# Altium schematic sheet OneRealayNode.SchDoc
size A4
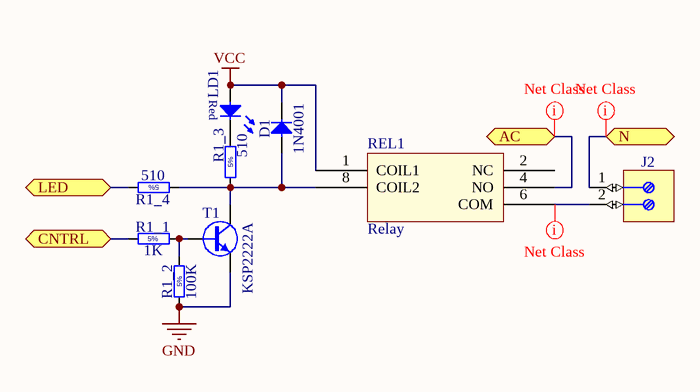
[diagram p0: OneRealayNode.SchDoc]

## Parts
D1  1N4001  [DO-41]
J2  Terminal  [WIELAND_25.161.0253.0]  (value not drawn)
LD1  Red  [LED_3MM_RED_1C-2A]  (value not drawn)
R1_1  1K  [RES_ARCOL_RCC025]
R1_2  100K  [RES_ARCOL_RCC025]
R1_3  510  [RES_ARCOL_RCC025]
R1_4  510  [RES_ARCOL_RCC025]
REL1  Relay  [RP78602]
T1  KSP2222A  [TO-92AA-P254]

## Ports
AC, CNTRL, LED, N

## Nets
GND: R1_2.1 T1.1(E)
VCC: D1.1(C) LD1.2(A) REL1.1(COIL1)
AC: REL1.4(NO) ; port AC
CNTRL: R1_1.1 ; port CNTRL
LED: R1_4.2 ; port LED
N: J2.1 ; port N
NetD1_2: D1.2(A) R1_3.1 R1_4.1 REL1.8(COIL2) T1.3(C)
NetJ2_2: J2.2 REL1.6(COM)
NetLD1_1: LD1.1(C) R1_3.2
NetR1_1_2: R1_1.2 R1_2.2 T1.2(B)

Not connected (* = marked no-connect by the designer): REL1 2(NC)

## Layout directives
net class HighCurrent: AC, N, NetJ2_2

## Notes on the sheet
- (in symbol RCF_5K1_5%_0.25W_+10-6PPM_ARCOL_RCC025) 5%

## Library data of the parts
D1 = 1N4007: Diode; Part Number: 1N4007; Part Description: Axial Lead Standard Recovery Rectifier; Manufacturer: FAIRCHILD SEMICONDUCTOR; Voltage: 1000V; Power: 1A; Table: Diodes; Component Kind: Standard; Component Type: Standard; Device: 1N4007; PackageDescription: DO-41, Diode, Axial, Body 4.7 x 2.7mm (LxDia. Max), Pin spacing 10.16mm; Manufacturer Part Number: 1N4007; Pin Count: 2; Case: DO-41; Mounted: Yes; Socket: No; SMD: No; ComponentHeight: 2.72mm; HelpURL: \\cern.ch\dfs\Applications\Altium\Datasheets\1N4007.pdf; ComponentLink1URL: \\cern.ch\dfs\Applications\Altium\Datasheets\1N4007_Package.pdf; ComponentLink1Description: Package Drawing; Author: CERN DEM JLC; CreateDate: 20.08.2008; LatestRevisionDate: 30.10.2013
J2 = WIELAND_25.161.0253.0: Terminal Block, 2 Positions, Screw Connection; Part Description: 16A 250VAC 2 Way PCB Terminal Block, Pitch 5mm, Screw Connection, Wire Size Max: 2.5mm²; Table: Miscellaneous; Part Number: WIELAND_25.161.0253.0; Component Kind: Standard; Component Type: Standard; Pin Count: 3; Family: Terminal; Mounted: Yes; Socket: No; SMD: No; Status: None; Manufacturer: WIELAND; Manufacturer Part Number: 25.161.0253.0; ComponentHeight: 15mm; HelpURL: \\cern.ch\dfs\Applications\Altium\Datasheets\WIELAND_25.161.0253.0.pdf; Author: CERN DEM JLC; CreateDate: 03.06.2009; LatestRevisionDate: 03.06.2009
LD1 = LED_AVAGO_HLMP-1700: LED Red 1C 2A; Part Description: 3mm Red LED; Manufacturer: AVAGO TECHNOLOGIES; Table: LEDs & Displays; Part Number: LED_AVAGO_HLMP-1700; Component Kind: Standard; Component Type: Standard; Color: Red; PackageDescription: LED, Red, Body Dia. 3.43 mm, Pin spacing 2.54mm; Manufacturer Part Number: HLMP-1700; Pin Count: 2; Mounted: Yes; Socket: No; SMD: No; ComponentHeight: 6.35mm(min); HelpURL: \\cern.ch\dfs\Applications\Altium\Datasheets\LED_AVAGO_HLMP-1700.pdf; Author: CERN DEM JLC; CreateDate: 12.06.2008; LatestRevisionDate: 17.03.2010
R1_1-R1_4 = RCF_5K1_5%_0.25W_+10-6PPM_ARCOL_RCC025: Resistor - 5%; Part Description: Solid Carbon Resistor RCC Series; Manufacturer: ARCOL; Manufacturer Part Number: RCC025 5k1 J; Power: 0.25W; TC: +10-6ppm/°C; Table: Resistors THD; Part Number: RCF_5K1_5%_0.25W_+10-6PPM_ARCOL_RCC025; Component Kind: Standard; Component Type: Standard; Pin Count: 2; Status: None; Tolerance: ±5%; Case: LS10.16 L6.3 x D2.4; Mounted: Yes; Socket: No; SMD: No; ComponentHeight: 2.5mm; HelpURL: \\cern.ch\dfs\Applications\Altium\Datasheets\RCF_ARCOL_RCC025.pdf; Author: CERN DEM JLC; CreateDate: 30.10.2013; LatestRevisionDate: 30.10.2013
  R1_1: Value: 1K
  R1_2: Value: 100K
  R1_3 R1_4: Value: 510
T1 = ZTX653: NPN Transistor; Part Number: ZTX653; Part Description: 100V 2A NPN Silicon Planar Medium Power Transistor; Manufacturer: ZETEX SEMICONDUCTORS; Table: Transistors; Component Kind: Standard; Component Type: Standard; Device: ZTX653; PackageDescription: TO-92 (TO226), Pitch 2.54mm, Flat Index, 3 In-Line, Bent Leads, Body Dia. 5.3mm; Manufacturer Part Number: ZTX653; Pin Count: 3; Case: TO-92; Mounted: Yes; Socket: No; SMD: No; ComponentHeight: 7.7mm; HelpURL: \\cern.ch\dfs\Applications\Altium\Datasheets\ZTX653.pdf; Author: CERN DEM JMW; CreateDate: 30.11.2009; LatestRevisionDate: 30.11.2009